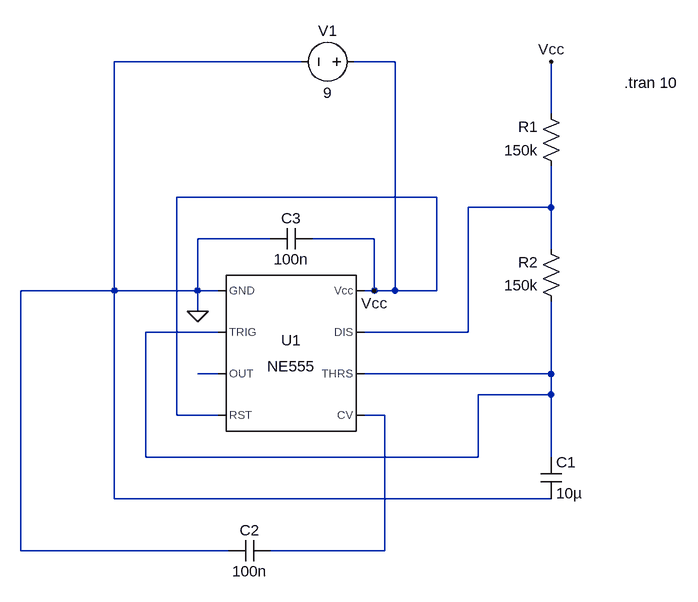
[diagram p0: schematic 555-Astable.asc]
555-Astable.asc, the LTspice schematic file:
Version 4.1
SHEET 1 932 680
WIRE 224 -304 -64 -304
WIRE 368 -304 304 -304
WIRE 608 -224 608 -304
WIRE 432 -96 32 -96
WIRE 608 -80 608 -144
WIRE 608 -80 480 -80
WIRE 176 -32 64 -32
WIRE 336 -32 240 -32
WIRE 608 -16 608 -80
WIRE -64 48 -64 -304
WIRE -64 48 -208 48
WIRE 64 48 64 -32
WIRE 64 48 -64 48
WIRE 96 48 64 48
WIRE 336 48 336 -32
WIRE 336 48 320 48
WIRE 368 48 368 -304
WIRE 368 48 336 48
WIRE 432 48 432 -96
WIRE 432 48 368 48
WIRE 64 80 64 48
WIRE 96 112 -16 112
WIRE 480 112 480 -80
WIRE 480 112 320 112
WIRE 96 176 64 176
WIRE 608 176 608 64
WIRE 608 176 320 176
WIRE 608 208 608 176
WIRE 608 208 496 208
WIRE 32 240 32 -96
WIRE 96 240 32 240
WIRE 352 240 320 240
WIRE -16 304 -16 112
WIRE 496 304 496 208
WIRE 496 304 -16 304
WIRE 608 304 608 208
WIRE -64 368 -64 48
WIRE 608 368 -64 368
WIRE -208 448 -208 48
WIRE 112 448 -208 448
WIRE 352 448 352 240
WIRE 352 448 176 448
FLAG 608 -304 Vcc
FLAG 336 48 Vcc
FLAG 64 80 0
SYMBOL res 624 -128 R180
WINDOW 0 36 76 Left 2
WINDOW 3 36 40 Left 2
SYMATTR InstName R1
SYMATTR Value 150k
SYMBOL res 624 80 R180
WINDOW 0 36 76 Left 2
WINDOW 3 36 40 Left 2
SYMATTR InstName R2
SYMATTR Value 150k
SYMBOL Misc\\NE555 208 144 R0
SYMATTR InstName U1
SYMBOL voltage 320 -304 R90
WINDOW 0 -32 56 VBottom 2
WINDOW 3 32 56 VTop 2
SYMATTR InstName V1
SYMATTR Value 9
SYMBOL cap 592 304 R0
SYMATTR InstName C1
SYMATTR Value 10µ
SYMBOL cap 176 432 R90
WINDOW 0 0 32 VBottom 2
WINDOW 3 32 32 VTop 2
SYMATTR InstName C2
SYMATTR Value 100n
SYMBOL cap 240 -48 R90
WINDOW 0 0 32 VBottom 2
WINDOW 3 32 32 VTop 2
SYMATTR InstName C3
SYMATTR Value 100n
TEXT 720 -272 Left 2 !.tran 10

The netlist it stands for:
* 555-Astable.asc
R1 N001 Vcc 150k
R2 N002 N001 150k
X§U1 0 N002 N003 Vcc N004 N002 N001 Vcc NE555  ; pins GND TRIG OUT RST CV THRS DIS Vcc
V1 Vcc 0 9
C1 N002 0 10µ
C2 N004 0 100n
C3 Vcc 0 100n
.tran 10
.lib NE555.sub
.backanno
.end